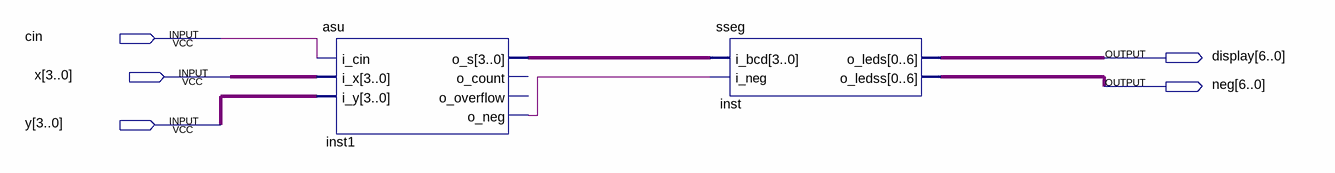
[diagram p0: schematic sheet]
// Quartus schematic fullasublock.bdf as structural Verilog: 2 symbols, 5 pins
module fullasublock (
  input  cin,
  input  [3:0] x,
  input  [3:0] y,
  output [6:0] display,
  output [6:0] neg
);

  wire inst1_o_neg;
  wire [3:0] inst1_o_s;

  asu inst1 (.i_cin(cin), .i_x(x), .i_y(y), .o_s(inst1_o_s), .o_neg(inst1_o_neg));  // open: o_count, o_overflow
  sseg inst (.i_bcd(inst1_o_s), .i_neg(inst1_o_neg), .o_leds(display), .o_ledss(neg));
endmodule
